# EasyEDA Pro project avaruusantenni_tallylight.eprj, schematic RF-Frontend
Create Date: 2023-12-21; Page Name: P1; Project Name: avaruusantenni_tallylight; Schematic Name: RF-Frontend; Update Date: 2023-12-21; Company: EasyEDA.com; Drawed: EasyEDA Pro; Page Size: A4; Part Number: JLCPCB-002; Reviewed: EasyEDA Pro; Version: V0.1
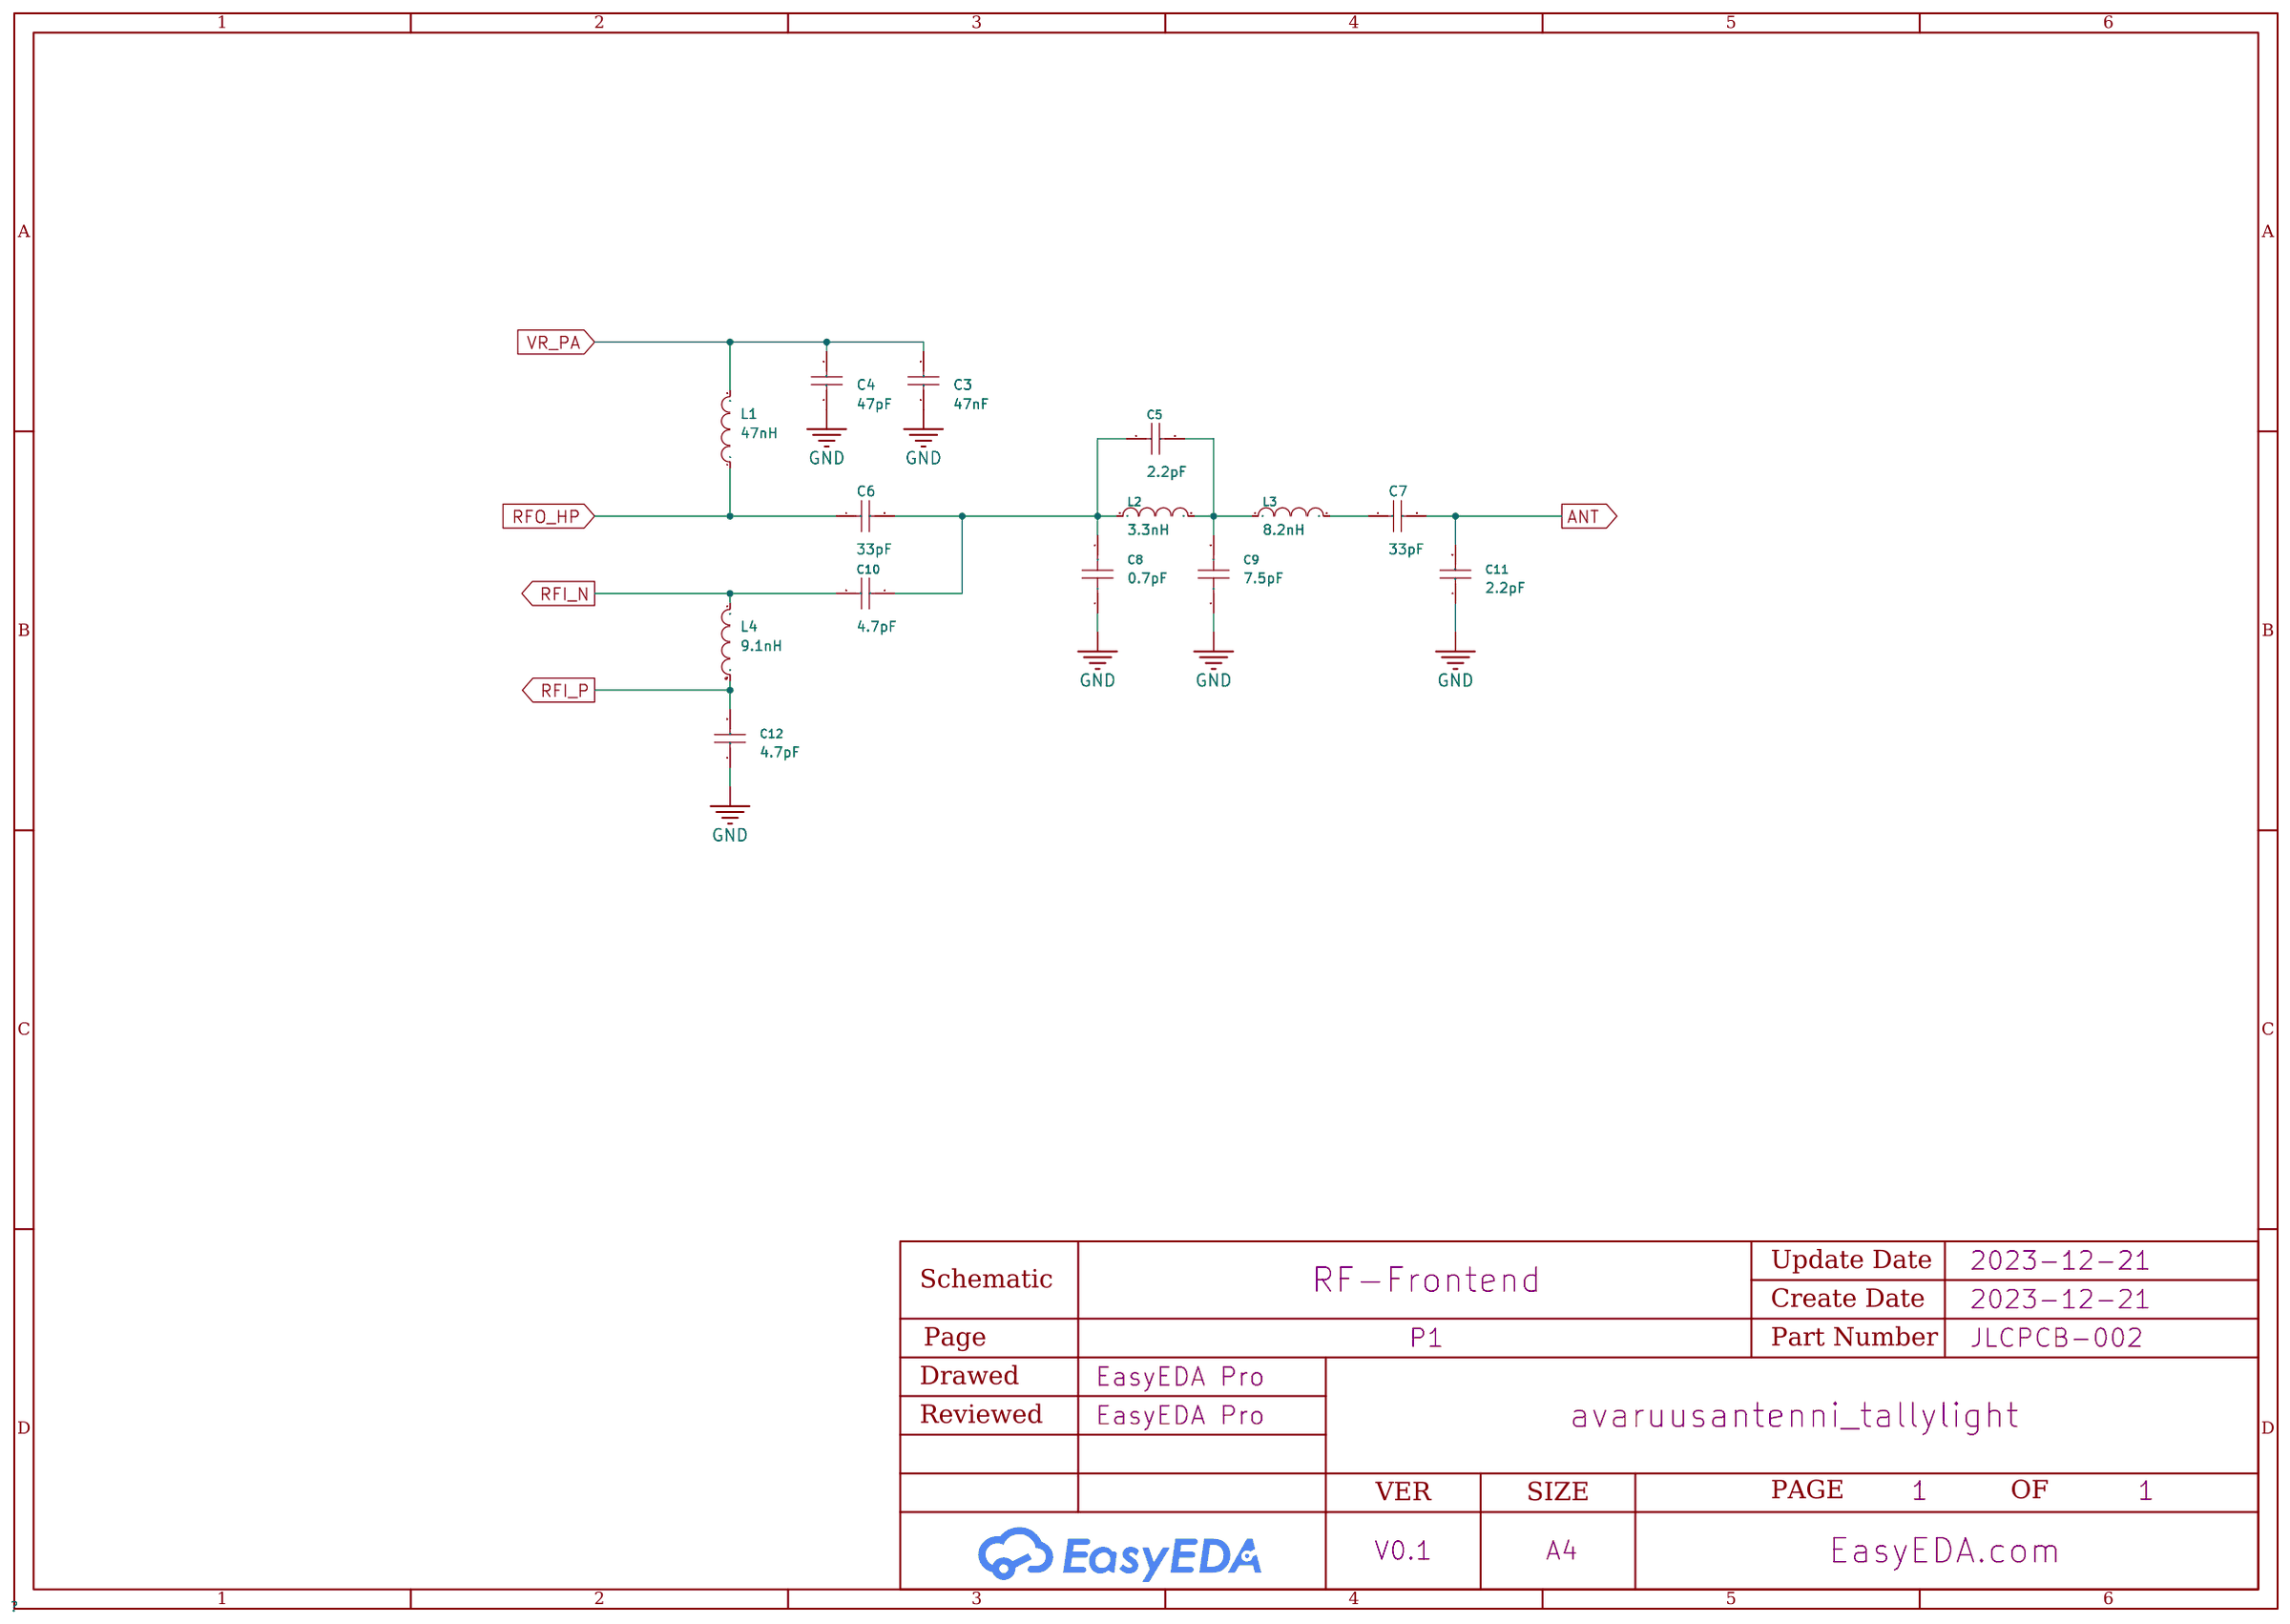
[diagram p7: schematic sheet]

## Parts
C3  47nF  [C0603]
C4  47pF  [C0402]
C5  2.2pF  [C0402]
C6  33pF  [C0402]
C7  33pF  [C0402]
C8  0.7pF  [C0402]
C9  7.5pF  [C0402]
C10  4.7pF  [C0402]
C11  2.2pF  [C0402]
C12  4.7pF  [C0402]
L1  47nH  [L0402]
L2  3.3nH  [L0402]
L3  8.2nH  [L0402]
L4  9.1nH  [L0402-RD]

## Library data of the parts
C3 = CL10B473KB8NNNC: Capacitance: Tolerance:±10% Tolerance:±10% Voltage Rated: Temperature Coefficient:; LCSC Part Name: 47nF ±10% 50V; Supplier Part: C1622; Manufacturer: SAMSUNG(三星); Supplier Footprint: 0603; JLCPCB Part Class: Basic Part; Datasheet: https://atta.szlcsc.com/upload/public/pdf/source/20160103/1457707684971.pdf; Supplier: LCSC; Tolerance: ±10%
C4 = 0402CG470J500NT: Capacitance: Tolerance:±5% Tolerance:±5% Voltage Rated: Temperature Coefficient:; LCSC Part Name: 47pF ±5% 50V; Supplier Part: C1567; Manufacturer: FH(风华); Supplier Footprint: 0402; JLCPCB Part Class: Basic Part; Datasheet: https://atta.szlcsc.com/upload/public/pdf/source/20200305/C486355_26A10D38EF8C2A5C37091D0039909270.pdf; Supplier: LCSC; Tolerance: ±5%
C5 C11 = 0402CG2R2C500NT: Capacitance: Voltage Rated: Temperature Coefficient:; LCSC Part Name: 2.2pF 50V ±0.25pF; Supplier Part: C1559; Manufacturer: FH(风华); Supplier Footprint: 0402; JLCPCB Part Class: Basic Part; Datasheet: https://atta.szlcsc.com/upload/public/pdf/source/20200305/C486355_26A10D38EF8C2A5C37091D0039909270.pdf; Supplier: LCSC
C6 C7 = 0402CG330J500NT: Capacitance: Tolerance:±5% Tolerance:±5% Voltage Rated: Temperature Coefficient:; LCSC Part Name: 33pF ±5% 50V; Supplier Part: C1562; Manufacturer: FH(风华); Supplier Footprint: 0402; JLCPCB Part Class: Basic Part; Datasheet: https://atta.szlcsc.com/upload/public/pdf/source/20200305/C486355_26A10D38EF8C2A5C37091D0039909270.pdf; Supplier: LCSC; Tolerance: ±5%
C8 = GJM1555C1HR70WB01D: Capacitance: Voltage Rated: Temperature Coefficient:; LCSC Part Name: 0.7pF 50V ±0.05pF; Supplier Part: C397301; Manufacturer: muRata(村田); Supplier Footprint: 0402; JLCPCB Part Class: Extended Part; Datasheet: https://atta.szlcsc.com/upload/public/pdf/source/20190712/C397301_3136EDCF87F7FC391160B7A0DF5E6086.pdf; Supplier: LCSC
C9 = CC0402BRNPO9BN7R5: Capacitance: Voltage Rated: Temperature Coefficient:; LCSC Part Name: 7.5pF 50V ±0.1pF; Supplier Part: C526970; Manufacturer: YAGEO(国巨); Supplier Footprint: 0402; JLCPCB Part Class: Extended Part; Datasheet: https://atta.szlcsc.com/upload/public/pdf/source/20200508/C526970_A0F4F7BE8A8C2A40A27319C4CDCA4465.pdf; Supplier: LCSC
C10 C12 = 0402CG4R7C500NT: Capacitance: Voltage Rated: Temperature Coefficient:; LCSC Part Name: 4.7pF 50V ±0.25pF; Supplier Part: C1569; Manufacturer: FH(风华); Supplier Footprint: 0402; JLCPCB Part Class: Extended Part; Datasheet: https://atta.szlcsc.com/upload/public/pdf/source/20200305/C486355_26A10D38EF8C2A5C37091D0039909270.pdf; Supplier: LCSC
L1 = LQG15HN47NJ02D: Inductance: Tolerance:±5% Tolerance:±5% Rated Current: Saturation Current (Isat):- DC Resistance (DCR): Q @ Freq:8@100MHz Frequency - Self Resonant: Ratings:; LCSC Part Name: 47nH ±5%; Supplier Part: C97988; Manufacturer: muRata(村田); Supplier Footprint: 0402; JLCPCB Part Class: Extended Part; Datasheet: https://atta.szlcsc.com/upload/public/pdf/source/20170310/1489116390137.pdf; Supplier: LCSC; Tolerance: ±5%; Q @ Freq: 8@100MHz
L2 = SDCL1005C3N3STDF_C16526: Inductance: Tolerance:- Tolerance:- Rated Current: DC Resistance (DCR): Saturation Current (Isat):- Q @ Freq:8@100MHz Frequency - Self Resonant: Ratings:; Supplier Part: C16526; Manufacturer: Sunlord(顺络); Manufacturer Part: SDCL1005C3N3STDF; Supplier Footprint: 0402; JLCPCB Part Class: Extended Part; Datasheet: https://atta.szlcsc.com/upload/public/pdf/source/20231027/6126A3AAC5912C34388756BE22DEE00C.pdf; Supplier: LCSC; Q @ Freq: 8@100MHz
L3 = SDCL1005C8N2JTDF: Inductance: Tolerance:±5% Tolerance:±5% Rated Current: Saturation Current (Isat):- DC Resistance (DCR): Q @ Freq:8@100MHz Frequency - Self Resonant: Ratings:; LCSC Part Name: 8.2nH ±5%; Supplier Part: C16208; Manufacturer: Sunlord(顺络); Supplier Footprint: 0402; JLCPCB Part Class: Extended Part; Datasheet: https://atta.szlcsc.com/upload/public/pdf/source/20210916/2389196E6DC4CA1121B2D3610B126F46.pdf; Supplier: LCSC; Tolerance: ±5%; Q @ Freq: 8@100MHz
L4 = VHF100505HQ9N1JT: Inductance: Tolerance: Tolerance: Rated Current: DC Resistance (DCR):; LCSC Part Name: 9.1nH ±5% 300mA; Supplier Part: C395077; Manufacturer: FH(风华); Supplier Footprint: 0402; JLCPCB Part Class: Extended Part; Supplier: LCSC

## Nets
GND: C3.1 C4.1 C8.1 C9.1 C11.1 C12.1
ANT: C7.2 C11.2
RFI_N: C10.2 L4.2
RFI_P: C12.2 L4.1
RFO_HP: C6.1 L1.1
VR_PA: C3.2 C4.2 L1.2
$3N1085: C5.1 C6.2 C8.2 C10.1 L2.1
$3N1088: C5.2 C9.2 L2.2 L3.1
$3N1091: C7.1 L3.2
